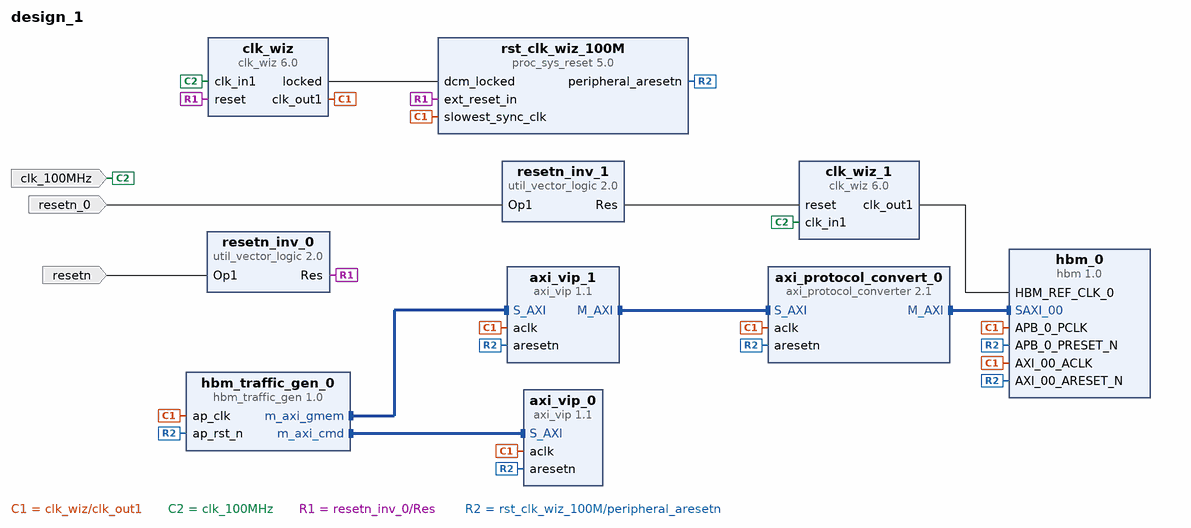
[diagram p0: block diagram of the top level]
# Vivado block design design_1, xcu280-fsvh2892-2L-e, Vivado 2020.2
create_bd_design design_1

create_bd_port -dir I -type clk clk_100MHz
set_property -dict {CONFIG.FREQ_HZ 100000000} [get_bd_ports clk_100MHz]
create_bd_port -dir I -type rst resetn
set_property -dict {CONFIG.POLARITY ACTIVE_LOW} [get_bd_ports resetn]
create_bd_port -dir I -type rst resetn_0
set_property -dict {CONFIG.POLARITY ACTIVE_LOW} [get_bd_ports resetn_0]

create_bd_cell -type ip -vlnv xilinx.com:ip:hbm:1.0 hbm_0
set_property -dict [list \
  CONFIG.USER_APB_EN false \
  CONFIG.USER_AXI_ADDR_SIZE 32 \
  CONFIG.USER_AXI_CLK1_FREQ 450 \
  CONFIG.USER_AXI_CLK_FREQ 450 \
  CONFIG.USER_CLK_SEL_LIST0 AXI_00_ACLK \
  CONFIG.USER_CLK_SEL_LIST1 AXI_16_ACLK \
  CONFIG.USER_CTRL_PHY_MODE Controller_and_Physical_Layer \
  CONFIG.USER_DEBUG_EN TRUE \
  CONFIG.USER_EN_PHY_ONLY FALSE \
  CONFIG.USER_EXAMPLE_TG SYNTHESIZABLE \
  CONFIG.USER_HBM_CP_1 3 \
  CONFIG.USER_HBM_DENSITY 4GB \
  CONFIG.USER_HBM_FBDIV_1 5 \
  CONFIG.USER_HBM_HEX_CP_RES_1 0x0000B300 \
  CONFIG.USER_HBM_HEX_FBDIV_CLKOUTDIV_1 0x00000142 \
  CONFIG.USER_HBM_HEX_LOCK_FB_REF_DLY_1 0x00000a0a \
  CONFIG.USER_HBM_LOCK_FB_DLY_1 10 \
  CONFIG.USER_HBM_LOCK_REF_DLY_1 10 \
  CONFIG.USER_HBM_RES_1 11 \
  CONFIG.USER_HBM_STACK 1 \
  CONFIG.USER_MC0_LOOKAHEAD_ACT false \
  CONFIG.USER_MC0_LOOKAHEAD_PCH false \
  CONFIG.USER_MC0_MAINTAIN_COHERENCY false \
  CONFIG.USER_MC0_REORDER_EN false \
  CONFIG.USER_MC0_REORDER_QUEUE_EN false \
  CONFIG.USER_MC10_LOOKAHEAD_ACT false \
  CONFIG.USER_MC10_LOOKAHEAD_PCH false \
  CONFIG.USER_MC10_MAINTAIN_COHERENCY false \
  CONFIG.USER_MC10_REORDER_EN false \
  CONFIG.USER_MC10_REORDER_QUEUE_EN false \
  CONFIG.USER_MC11_LOOKAHEAD_ACT false \
  CONFIG.USER_MC11_LOOKAHEAD_PCH false \
  CONFIG.USER_MC11_MAINTAIN_COHERENCY false \
  CONFIG.USER_MC11_REORDER_EN false \
  CONFIG.USER_MC11_REORDER_QUEUE_EN false \
  CONFIG.USER_MC12_LOOKAHEAD_ACT false \
  CONFIG.USER_MC12_LOOKAHEAD_PCH false \
  CONFIG.USER_MC12_MAINTAIN_COHERENCY false \
  CONFIG.USER_MC12_REORDER_EN false \
  CONFIG.USER_MC12_REORDER_QUEUE_EN false \
  CONFIG.USER_MC13_LOOKAHEAD_ACT false \
  CONFIG.USER_MC13_LOOKAHEAD_PCH false \
  CONFIG.USER_MC13_MAINTAIN_COHERENCY false \
  CONFIG.USER_MC13_REORDER_EN false \
  CONFIG.USER_MC13_REORDER_QUEUE_EN false \
  CONFIG.USER_MC14_LOOKAHEAD_ACT false \
  CONFIG.USER_MC14_LOOKAHEAD_PCH false \
  CONFIG.USER_MC14_MAINTAIN_COHERENCY false \
  CONFIG.USER_MC14_REORDER_EN false \
  CONFIG.USER_MC14_REORDER_QUEUE_EN false \
  CONFIG.USER_MC15_LOOKAHEAD_ACT false \
  CONFIG.USER_MC15_LOOKAHEAD_PCH false \
  CONFIG.USER_MC15_MAINTAIN_COHERENCY false \
  CONFIG.USER_MC15_REORDER_EN false \
  CONFIG.USER_MC15_REORDER_QUEUE_EN false \
  CONFIG.USER_MC1_LOOKAHEAD_ACT false \
  CONFIG.USER_MC1_LOOKAHEAD_PCH false \
  CONFIG.USER_MC1_MAINTAIN_COHERENCY false \
  CONFIG.USER_MC1_REORDER_EN false \
  CONFIG.USER_MC1_REORDER_QUEUE_EN false \
  CONFIG.USER_MC2_LOOKAHEAD_ACT false \
  CONFIG.USER_MC2_LOOKAHEAD_PCH false \
  CONFIG.USER_MC2_MAINTAIN_COHERENCY false \
  CONFIG.USER_MC2_REORDER_EN false \
  CONFIG.USER_MC2_REORDER_QUEUE_EN false \
  CONFIG.USER_MC3_LOOKAHEAD_ACT false \
  CONFIG.USER_MC3_LOOKAHEAD_PCH false \
  CONFIG.USER_MC3_MAINTAIN_COHERENCY false \
  CONFIG.USER_MC3_REORDER_EN false \
  CONFIG.USER_MC3_REORDER_QUEUE_EN false \
  CONFIG.USER_MC4_LOOKAHEAD_ACT false \
  CONFIG.USER_MC4_LOOKAHEAD_PCH false \
  CONFIG.USER_MC4_MAINTAIN_COHERENCY false \
  CONFIG.USER_MC4_REORDER_EN false \
  CONFIG.USER_MC4_REORDER_QUEUE_EN false \
  CONFIG.USER_MC5_LOOKAHEAD_ACT false \
  CONFIG.USER_MC5_LOOKAHEAD_PCH false \
  CONFIG.USER_MC5_MAINTAIN_COHERENCY false \
  CONFIG.USER_MC5_REORDER_EN false \
  CONFIG.USER_MC5_REORDER_QUEUE_EN false \
  CONFIG.USER_MC6_LOOKAHEAD_ACT false \
  CONFIG.USER_MC6_LOOKAHEAD_PCH false \
  CONFIG.USER_MC6_MAINTAIN_COHERENCY false \
  CONFIG.USER_MC6_REORDER_EN false \
  CONFIG.USER_MC6_REORDER_QUEUE_EN false \
  CONFIG.USER_MC7_LOOKAHEAD_ACT false \
  CONFIG.USER_MC7_LOOKAHEAD_PCH false \
  CONFIG.USER_MC7_MAINTAIN_COHERENCY false \
  CONFIG.USER_MC7_REORDER_EN false \
  CONFIG.USER_MC7_REORDER_QUEUE_EN false \
  CONFIG.USER_MC8_LOOKAHEAD_ACT false \
  CONFIG.USER_MC8_LOOKAHEAD_PCH false \
  CONFIG.USER_MC8_MAINTAIN_COHERENCY false \
  CONFIG.USER_MC8_REORDER_EN false \
  CONFIG.USER_MC8_REORDER_QUEUE_EN false \
  CONFIG.USER_MC9_LOOKAHEAD_ACT false \
  CONFIG.USER_MC9_LOOKAHEAD_PCH false \
  CONFIG.USER_MC9_MAINTAIN_COHERENCY false \
  CONFIG.USER_MC9_REORDER_EN false \
  CONFIG.USER_MC9_REORDER_QUEUE_EN false \
  CONFIG.USER_MC_ENABLE_00 TRUE \
  CONFIG.USER_MC_ENABLE_01 TRUE \
  CONFIG.USER_MC_ENABLE_02 TRUE \
  CONFIG.USER_MC_ENABLE_03 TRUE \
  CONFIG.USER_MC_ENABLE_04 TRUE \
  CONFIG.USER_MC_ENABLE_05 TRUE \
  CONFIG.USER_MC_ENABLE_06 TRUE \
  CONFIG.USER_MC_ENABLE_07 TRUE \
  CONFIG.USER_MC_ENABLE_08 FALSE \
  CONFIG.USER_MC_ENABLE_09 FALSE \
  CONFIG.USER_MC_ENABLE_10 FALSE \
  CONFIG.USER_MC_ENABLE_11 FALSE \
  CONFIG.USER_MC_ENABLE_12 FALSE \
  CONFIG.USER_MC_ENABLE_13 FALSE \
  CONFIG.USER_MC_ENABLE_14 FALSE \
  CONFIG.USER_MC_ENABLE_15 FALSE \
  CONFIG.USER_MC_ENABLE_APB_00 TRUE \
  CONFIG.USER_MC_ENABLE_APB_01 FALSE \
  CONFIG.USER_PHY_ENABLE_08 FALSE \
  CONFIG.USER_PHY_ENABLE_09 FALSE \
  CONFIG.USER_PHY_ENABLE_10 FALSE \
  CONFIG.USER_PHY_ENABLE_11 FALSE \
  CONFIG.USER_PHY_ENABLE_12 FALSE \
  CONFIG.USER_PHY_ENABLE_13 FALSE \
  CONFIG.USER_PHY_ENABLE_14 FALSE \
  CONFIG.USER_PHY_ENABLE_15 FALSE \
  CONFIG.USER_SAXI_01 false \
  CONFIG.USER_SAXI_02 false \
  CONFIG.USER_SAXI_03 false \
  CONFIG.USER_SAXI_04 false \
  CONFIG.USER_SAXI_05 false \
  CONFIG.USER_SAXI_06 false \
  CONFIG.USER_SAXI_07 false \
  CONFIG.USER_SAXI_08 false \
  CONFIG.USER_SAXI_09 false \
  CONFIG.USER_SAXI_10 false \
  CONFIG.USER_SAXI_11 false \
  CONFIG.USER_SAXI_12 false \
  CONFIG.USER_SAXI_13 false \
  CONFIG.USER_SAXI_14 false \
  CONFIG.USER_SAXI_15 false \
  CONFIG.USER_SAXI_16 false \
  CONFIG.USER_SAXI_17 false \
  CONFIG.USER_SAXI_18 false \
  CONFIG.USER_SAXI_19 false \
  CONFIG.USER_SAXI_20 false \
  CONFIG.USER_SAXI_21 false \
  CONFIG.USER_SAXI_22 false \
  CONFIG.USER_SAXI_23 false \
  CONFIG.USER_SAXI_24 false \
  CONFIG.USER_SAXI_25 false \
  CONFIG.USER_SAXI_26 false \
  CONFIG.USER_SAXI_27 false \
  CONFIG.USER_SAXI_28 false \
  CONFIG.USER_SAXI_29 false \
  CONFIG.USER_SAXI_30 false \
  CONFIG.USER_SAXI_31 false \
  CONFIG.USER_SWITCH_ENABLE_00 TRUE \
  CONFIG.USER_tFAW_0 0x00F \
  CONFIG.USER_tFAW_1 0x00F \
  CONFIG.USER_tRCDRD_0 0x0D \
  CONFIG.USER_tRCDRD_1 0x0D \
  CONFIG.USER_tRCDWR_0 0x09 \
  CONFIG.USER_tRCDWR_1 0x09 \
  CONFIG.USER_tRFC_0 0x0EA \
  CONFIG.USER_tRFC_1 0x0EA \
  CONFIG.USER_tRP_0 0x0D \
  CONFIG.USER_tRP_1 0x0D \
  CONFIG.USER_tRRDL_0 0x04 \
  CONFIG.USER_tRRDL_1 0x04 \
  CONFIG.USER_tRRDS_0 0x04 \
  CONFIG.USER_tRRDS_1 0x04 \
  CONFIG.USER_tWR_0 0x0F \
  CONFIG.USER_tWR_1 0x0F \
  CONFIG.USER_tXP_0 0x07 \
  CONFIG.USER_tXP_1 0x07 \
] [get_bd_cells hbm_0]
create_bd_cell -type ip -vlnv xilinx.com:ip:axi_vip:1.1 axi_vip_0
set_property -dict [list \
  CONFIG.ADDR_WIDTH 32 \
  CONFIG.DATA_WIDTH 32 \
  CONFIG.INTERFACE_MODE SLAVE \
  CONFIG.PROTOCOL AXI4 \
  CONFIG.READ_WRITE_MODE READ_WRITE \
] [get_bd_cells axi_vip_0]
create_bd_cell -type ip -vlnv xilinx.com:ip:axi_vip:1.1 axi_vip_1
create_bd_cell -type ip -vlnv xilinx.com:ip:clk_wiz:6.0 clk_wiz
set_property -dict {CONFIG.RESET_BOARD_INTERFACE resetn CONFIG.USE_BOARD_FLOW true} [get_bd_cells clk_wiz]
create_bd_cell -type ip -vlnv xilinx.com:ip:clk_wiz:6.0 clk_wiz_1
set_property -dict {CONFIG.RESET_BOARD_INTERFACE resetn CONFIG.USE_BOARD_FLOW true} [get_bd_cells clk_wiz_1]
create_bd_cell -type ip -vlnv xilinx.com:ip:util_vector_logic:2.0 resetn_inv_0
set_property -dict {CONFIG.C_OPERATION not CONFIG.C_SIZE 1} [get_bd_cells resetn_inv_0]
create_bd_cell -type ip -vlnv xilinx.com:ip:util_vector_logic:2.0 resetn_inv_1
set_property -dict {CONFIG.C_OPERATION not CONFIG.C_SIZE 1} [get_bd_cells resetn_inv_1]
create_bd_cell -type ip -vlnv xilinx.com:ip:proc_sys_reset:5.0 rst_clk_wiz_100M
create_bd_cell -type ip -vlnv xilinx.com:hls:hbm_traffic_gen:1.0 hbm_traffic_gen_0
create_bd_cell -type ip -vlnv xilinx.com:ip:axi_protocol_converter:2.1 axi_protocol_convert_0
set_property -dict {CONFIG.DATA_WIDTH 256 CONFIG.MI_PROTOCOL AXI3 CONFIG.TRANSLATION_MODE 2} [get_bd_cells axi_protocol_convert_0]

# ---- connections ----

connect_bd_intf_net [get_bd_intf_pins hbm_traffic_gen_0/m_axi_gmem] [get_bd_intf_pins axi_vip_1/S_AXI]
connect_bd_intf_net [get_bd_intf_pins hbm_traffic_gen_0/m_axi_cmd] [get_bd_intf_pins axi_vip_0/S_AXI]
connect_bd_intf_net [get_bd_intf_pins axi_vip_1/M_AXI] [get_bd_intf_pins axi_protocol_convert_0/S_AXI]
connect_bd_intf_net [get_bd_intf_pins hbm_0/SAXI_00] [get_bd_intf_pins axi_protocol_convert_0/M_AXI]
connect_bd_net [get_bd_pins clk_wiz/clk_out1] \
  [get_bd_pins hbm_0/APB_0_PCLK] [get_bd_pins rst_clk_wiz_100M/slowest_sync_clk] [get_bd_pins hbm_0/AXI_00_ACLK] \
  [get_bd_pins axi_vip_0/aclk] [get_bd_pins axi_vip_1/aclk] [get_bd_pins hbm_traffic_gen_0/ap_clk] \
  [get_bd_pins axi_protocol_convert_0/aclk]
connect_bd_net [get_bd_pins clk_wiz_1/clk_out1] [get_bd_pins hbm_0/HBM_REF_CLK_0]
connect_bd_net [get_bd_ports clk_100MHz] [get_bd_pins clk_wiz/clk_in1] [get_bd_pins clk_wiz_1/clk_in1]
connect_bd_net [get_bd_ports resetn] [get_bd_pins resetn_inv_0/Op1]
connect_bd_net [get_bd_pins resetn_inv_0/Res] [get_bd_pins clk_wiz/reset] [get_bd_pins rst_clk_wiz_100M/ext_reset_in]
connect_bd_net -net resetn_0_1 [get_bd_ports resetn_0] [get_bd_pins resetn_inv_1/Op1]
connect_bd_net [get_bd_pins resetn_inv_1/Res] [get_bd_pins clk_wiz_1/reset]
connect_bd_net [get_bd_pins clk_wiz/locked] [get_bd_pins rst_clk_wiz_100M/dcm_locked]
connect_bd_net [get_bd_pins rst_clk_wiz_100M/peripheral_aresetn] \
  [get_bd_pins axi_vip_0/aresetn] [get_bd_pins axi_vip_1/aresetn] [get_bd_pins hbm_0/AXI_00_ARESET_N] \
  [get_bd_pins hbm_traffic_gen_0/ap_rst_n] [get_bd_pins axi_protocol_convert_0/aresetn] [get_bd_pins hbm_0/APB_0_PRESET_N]

# ---- address map ----
assign_bd_address -offset 0x0000000044A00000 -range 4K -target_address_space [get_bd_addr_spaces hbm_traffic_gen_0/Data_m_axi_cmd] [get_bd_addr_segs axi_vip_0/S_AXI/Reg]
assign_bd_address -offset 0x0000000000000000 -range 256M -target_address_space [get_bd_addr_spaces hbm_traffic_gen_0/Data_m_axi_gmem] [get_bd_addr_segs hbm_0/SAXI_00/HBM_MEM00]
assign_bd_address -offset 0x0000000010000000 -range 256M -target_address_space [get_bd_addr_spaces hbm_traffic_gen_0/Data_m_axi_gmem] [get_bd_addr_segs hbm_0/SAXI_00/HBM_MEM01]
assign_bd_address -offset 0x0000000020000000 -range 256M -target_address_space [get_bd_addr_spaces hbm_traffic_gen_0/Data_m_axi_gmem] [get_bd_addr_segs hbm_0/SAXI_00/HBM_MEM02]
assign_bd_address -offset 0x0000000030000000 -range 256M -target_address_space [get_bd_addr_spaces hbm_traffic_gen_0/Data_m_axi_gmem] [get_bd_addr_segs hbm_0/SAXI_00/HBM_MEM03]
assign_bd_address -offset 0x0000000040000000 -range 256M -target_address_space [get_bd_addr_spaces hbm_traffic_gen_0/Data_m_axi_gmem] [get_bd_addr_segs hbm_0/SAXI_00/HBM_MEM04]
assign_bd_address -offset 0x0000000050000000 -range 256M -target_address_space [get_bd_addr_spaces hbm_traffic_gen_0/Data_m_axi_gmem] [get_bd_addr_segs hbm_0/SAXI_00/HBM_MEM05]
assign_bd_address -offset 0x0000000060000000 -range 256M -target_address_space [get_bd_addr_spaces hbm_traffic_gen_0/Data_m_axi_gmem] [get_bd_addr_segs hbm_0/SAXI_00/HBM_MEM06]
assign_bd_address -offset 0x0000000070000000 -range 256M -target_address_space [get_bd_addr_spaces hbm_traffic_gen_0/Data_m_axi_gmem] [get_bd_addr_segs hbm_0/SAXI_00/HBM_MEM07]
assign_bd_address -offset 0x0000000080000000 -range 256M -target_address_space [get_bd_addr_spaces hbm_traffic_gen_0/Data_m_axi_gmem] [get_bd_addr_segs hbm_0/SAXI_00/HBM_MEM08]
assign_bd_address -offset 0x0000000090000000 -range 256M -target_address_space [get_bd_addr_spaces hbm_traffic_gen_0/Data_m_axi_gmem] [get_bd_addr_segs hbm_0/SAXI_00/HBM_MEM09]
assign_bd_address -offset 0x00000000A0000000 -range 256M -target_address_space [get_bd_addr_spaces hbm_traffic_gen_0/Data_m_axi_gmem] [get_bd_addr_segs hbm_0/SAXI_00/HBM_MEM10]
assign_bd_address -offset 0x00000000B0000000 -range 256M -target_address_space [get_bd_addr_spaces hbm_traffic_gen_0/Data_m_axi_gmem] [get_bd_addr_segs hbm_0/SAXI_00/HBM_MEM11]
assign_bd_address -offset 0x00000000C0000000 -range 256M -target_address_space [get_bd_addr_spaces hbm_traffic_gen_0/Data_m_axi_gmem] [get_bd_addr_segs hbm_0/SAXI_00/HBM_MEM12]
assign_bd_address -offset 0x00000000D0000000 -range 256M -target_address_space [get_bd_addr_spaces hbm_traffic_gen_0/Data_m_axi_gmem] [get_bd_addr_segs hbm_0/SAXI_00/HBM_MEM13]
assign_bd_address -offset 0x00000000E0000000 -range 256M -target_address_space [get_bd_addr_spaces hbm_traffic_gen_0/Data_m_axi_gmem] [get_bd_addr_segs hbm_0/SAXI_00/HBM_MEM14]
assign_bd_address -offset 0x00000000F0000000 -range 256M -target_address_space [get_bd_addr_spaces hbm_traffic_gen_0/Data_m_axi_gmem] [get_bd_addr_segs hbm_0/SAXI_00/HBM_MEM15]

validate_bd_design
save_bd_design
